# EAGLE design untitled (EAGLE 9.6.2)
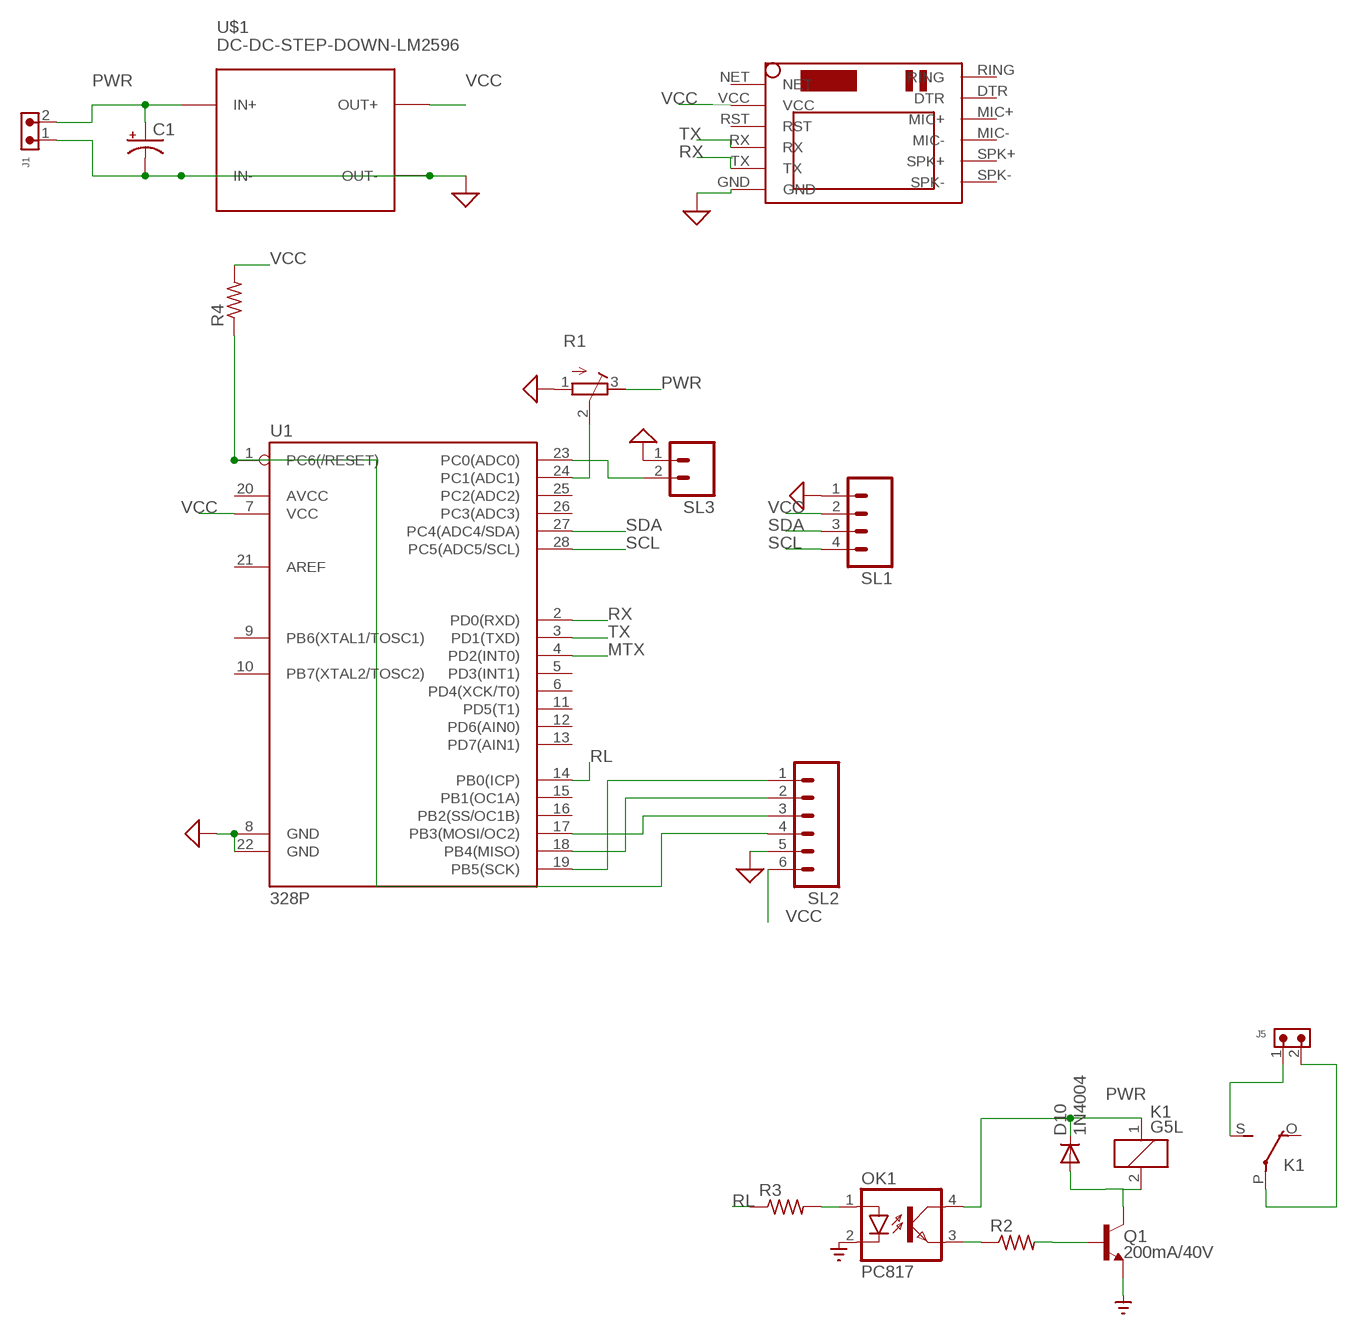
[diagram p0: schematic, sheet 1]

## Parts
C1  CPOL-USE7.5-16  [E7,5-16]
D10  1N4004  [DO41-10]
J1  691305530002  [691305530002]
J5  691305530002  [691305530002]
K1  G5L  [G5LE]
OK1  PC817  [DIL04]
Q1  200mA/40V  TRANS_NPN-2N3904  [TO-92]
R1  R-TRIMM3296Y  [RTRIM3296Y]
R2  R-US_0207/10  [0207/10]
R3  R-US_0207/12  [0207/12]
R4  R-US_0207/10  [0207/10]
SL1  M04  [04P]
SL2  M06  [06P]
SL3  M02  [02P]
U1  328P  ATMEGA328P_PDIP  [DIP28]
U$1  DC-DC-STEP-DOWN-LM2596  [DC-DC-STEP-DOWN-LM2596]
U$2  SIM800LMODULE  [SIM800LMODULE]

## Nets
GND: C1.- J1.1 OK1.2(C) Q1.1(E) R1.1(A) SL1.1 SL2.5 SL3.1 U1.8(GND) U1.22(GND) U$1.IN- U$1.OUT- U$2.GND ; supply symbol labelled SUP, SUPPLY_BRASTAN_GND_
MTX: U1.4(PD2(INT0))
N$1: OK1.1(A) R3.2
N$3: R1.2(S) U1.24(PC1(ADC1))
N$4: SL2.1 U1.19(PB5(SCK))
N$5: SL2.2 U1.18(PB4(MISO))
N$6: SL2.3 U1.17(PB3(MOSI/OC2))
N$7: R4.1 SL2.4 U1.1(PC6(/RESET))
N$8: SL3.2 U1.23(PC0(ADC0))
N$9: D10.A K1.2 Q1.3(C)
N$10: J5.2 K1.P(2:P)
N$11: J5.1 K1.S(2:S)
N$12: Q1.2(B) R2.2
N$13: OK1.3(EMIT) R2.1
PWR: C1.+ D10.C J1.2 K1.1 OK1.4(COL) R1.3(E) U$1.IN+
RL: R3.1 U1.14(PB0(ICP))
RX: U1.2(PD0(RXD)) U$2.TX
SCL: SL1.4 U1.28(PC5(ADC5/SCL))
SDA: SL1.3 U1.27(PC4(ADC4/SDA))
TX: U1.3(PD1(TXD)) U$2.RX
VCC: R4.2 SL1.2 SL2.6 U1.7(VCC) U$1.OUT+ U$2.VCC
Unconnected: K1.O(2:O) U1.5(PD3(INT1)) U1.6(PD4(XCK/T0)) U1.9(PB6(XTAL1/TOSC1)) U1.10(PB7(XTAL2/TOSC2)) U1.11(PD5(T1)) U1.12(PD6(AIN0)) U1.13(PD7(AIN1)) U1.15(PB1(OC1A)) U1.16(PB2(SS/OC1B)) U1.20(AVCC) U1.21(AREF) U1.25(PC2(ADC2)) U1.26(PC3(ADC3)) U$2.DTR U$2.MIC+ U$2.MIC- U$2.NET U$2.RING U$2.RST U$2.SPK+ U$2.SPK-

## Library data of the parts
C1 = rcl:CPOL-US: POLARIZED CAPACITOR, American symbol; SPICEPREFIX: C
D10 = adafruit:1N4004: DIODE General purpose 1N400x type rectifier (With bigger pads) http://www.ladyada.net/library/pcb/eaglelibrary.html
J1 J5 = Wurth_Connectors_WR-TBL Pluggable Connector:691305530002: WR-TBL Serie 3055 - 5,08 mm - PCB Header Vertical Entry with Plastic Latches KIND PROPERTIES Pitch 5.08 mm MATERIAL PROPERTIES Insulator Material PA66 Insulator Flammability Rating UL94 V-0 Insulator Color Green Terminal Material Copper Alloy Terminal Plating Tin-plated surface GENERAL INFORMATION Operating Temperature -40 up to +105 °C ELECTRICAL PROPERTIES IR UL 16 A Working Voltage [UL] 300 V (AC) Withstanding Voltage [UL] 2500 V (AC) Contact Resistance [UL] 20 mΩ CERTIFICATION UL Approval E315414 <https://www.we-online.com/catalog/media/o135349v209%20Family_WR-TBL3_6913055300xx.jpg> Details see: https://www.we-online.com/catalog/en/TBL_5_08_3055_6913055300XX/ Updated by Ella Wu 2019-12-30 2019(C) Wurth Elektronik; DATASHEET-URL: https://www.we-online.com/catalog/datasheet/691305530002.pdf; IR-UL: 16A; MOUNT: THT; PART-NUMBER: 691305530002; PINS: 2; PITCH: 5.08mm; TYPE: Vertical; WORKING-VOLTAGE-UL: 300V (AC)
K1 = relay:G5L: RELAY 1 x switch, 10 A/120 V AC, 8 A/30 V ADC, Omron; OC_FARNELL: unknown; OC_NEWARK: unknown
OK1 = optocoupler:PC817: SHARP OPTO COUPLER; MPN: PC817X4J000F; OC_FARNELL: 9707727; OC_NEWARK: 97K7059
Q1 = SparkFun-DiscreteSemi:TRANS_NPN: NPN transistor Current controlled devices typically used to amplify current or used as a switch. BC547 - COM-08928 <http://www.sparkfun.com/products/8928> (TO-92 45V 100mA) (1.Collector 2.Base 3.Emitter) 2N3904 - COM-00521 <http://www.sparkfun.com/products/521> (TO-92 40V 200mA) (1.Emitter 2.Base 3.Collector) P2N2222A - COM-12852 <http://www.sparkfun.com/products/12852> (TO-92 40V 600mA) (1.Collector 2.Base 3.Emitter); PROD_ID: TRANS-08447
R1 = rcl:R-TRIMM: Trimm resistor; SPICEMODEL: X; SPICEPREFIXL: POT
R2 R4 = BeagleBone_Black_Wireless:R-US_: RESISTOR, American symbol
R3 = adafruit:R-US_: RESISTOR, American symbol
SL1 = con-amp-quick:M04: AMP QUICK CONNECTOR; OC_FARNELL: unknown; OC_NEWARK: unknown
SL2 = con-amp-quick:M06: AMP QUICK CONNECTOR; OC_FARNELL: unknown; OC_NEWARK: unknown
SL3 = con-amp-quick:M02: AMP QUICK CONNECTOR; OC_FARNELL: unknown; OC_NEWARK: unknown
U1 = SparkFun-IC-Microcontroller:ATMEGA328P_PDIP: Atmel 328P Through hole ATMEGA328P uC used in the Arduino 32kb flash, 1k EEPROM, 2k SRAM Datasheet <http://www.sparkfun.com/datasheets/Components/SMD/ATMega328.pdf> SparkFun Products Storefront component: AVR 28 Pin 20MHz 32K 6A/D - ATMega328P <https://www.sparkfun.com/products/9061> (COM-09061) SparkFun Simon Says - Through-Hole Soldering Kit <https://www.sparkfun.com/products/10547> (KIT-10547) SparkFun Learn to Solder - Simon Says <https://www.sparkfun.com/products/13708> (KIT-13708) SparkFun BigTime Watch Kit <https://www.sparkfun.com/products/11734> (KIT-11734) SparkFun ClockIt <https://www.sparkfun.com/products/10930> (KIT-10930) SparkFun Serial Enabled LCD Kit <https://www.sparkfun.com/products/10097> (LCD-10097) SparkFun Simon Tilts - Through Hole Soldering Kit <https://www.sparkfun.com/products/12634> (KIT-12634) SparkFun Frequency Counter Kit <https://www.sparkfun.com/products/10140> (KIT-10140) FabFM Radio Kit <https://www.sparkfun.com/products/11043> (KIT-11043) SparkFun Binary Blaster Kit <https://www.sparkfun.com/products/12037> (KIT-12037) SparkFun Metro-Gnome <https://www.sparkfun.com/products/9236> (KIT-09236) ATmega328 with Arduino Optiboot (Uno) <https://www.sparkfun.com/products/10524> (DEV-10524); PROD_ID: IC-09136
U$1 = diy-modules:DC-DC-STEP-DOWN-LM2596: DC/DC Step-Down Regulator based on LM2596-ADJ chip LM2596 datasheet available here: http://www.ti.com/lit/ds/symlink/lm2596.pdf Click here to find device on ebay.com <http://www.ebay.com/sch/lm2596+power+regulator>
U$2 = SIM800LMODULE:SIM800LMODULE: SIM800L Module

## Board
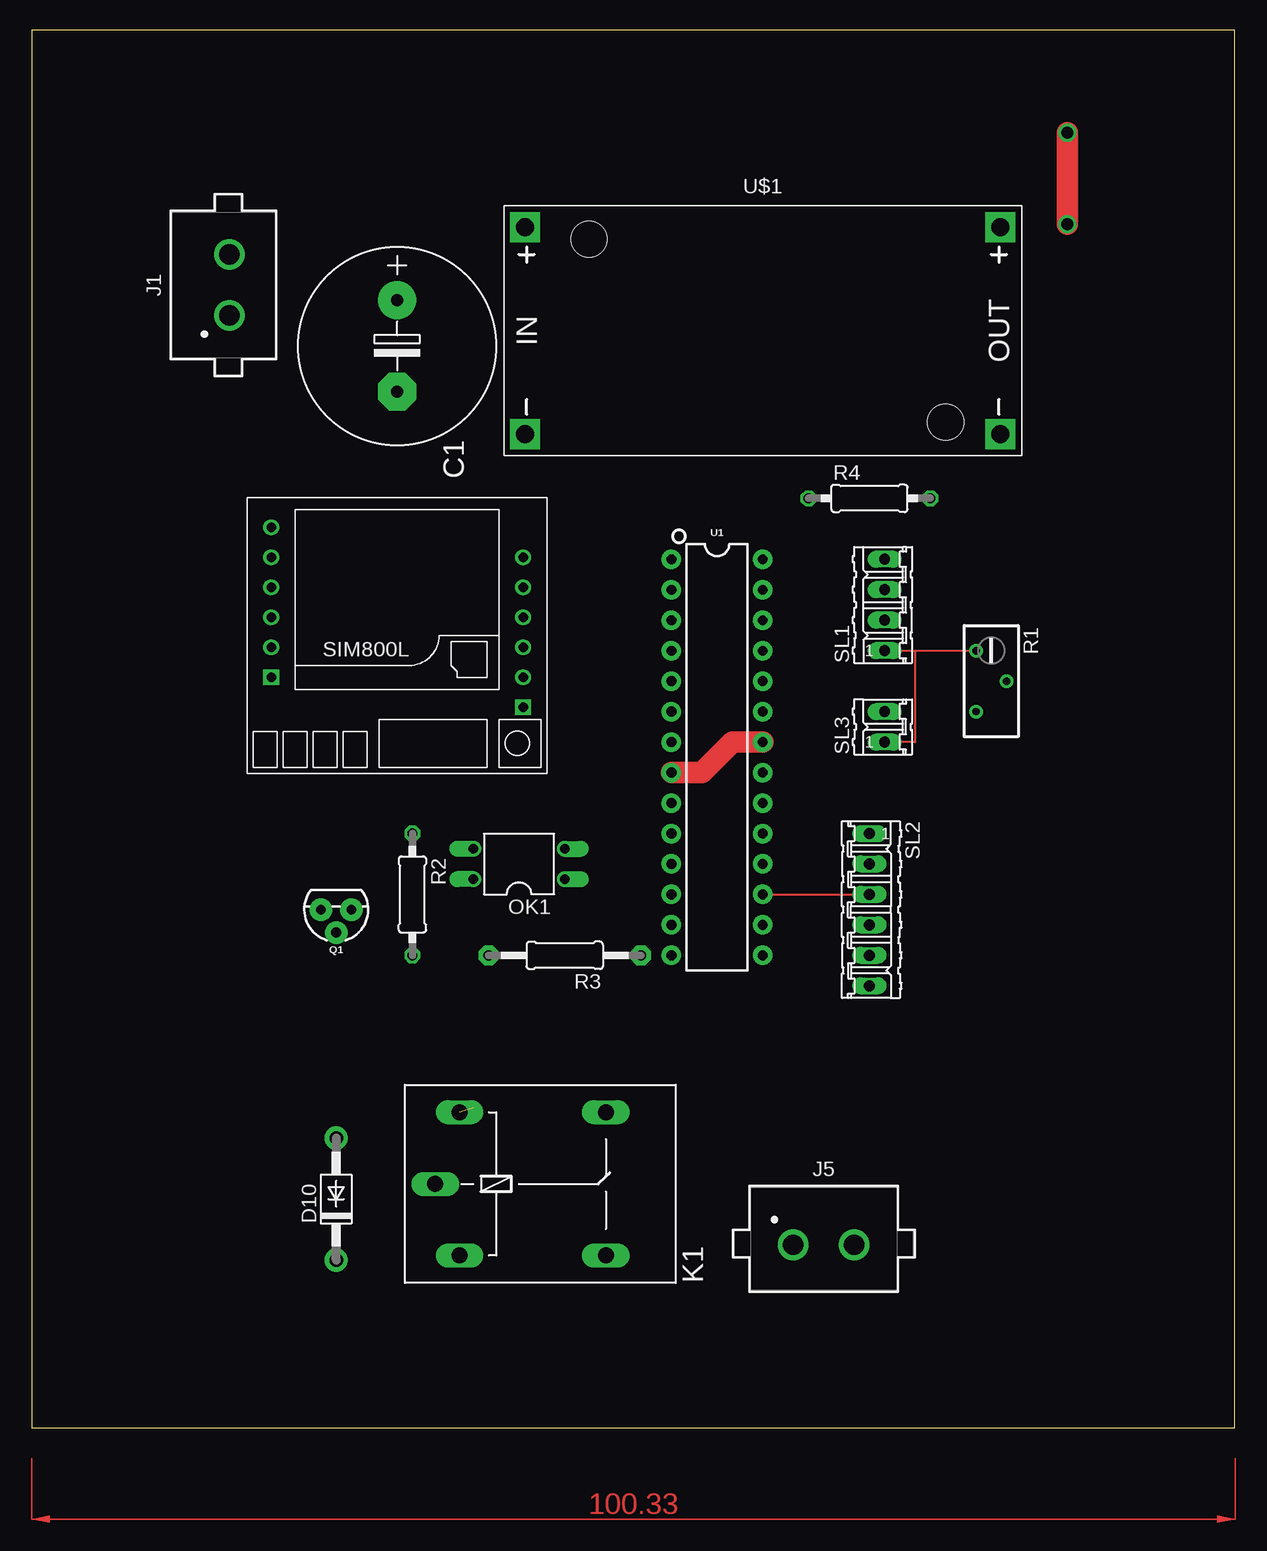
[diagram p1: board, top side]
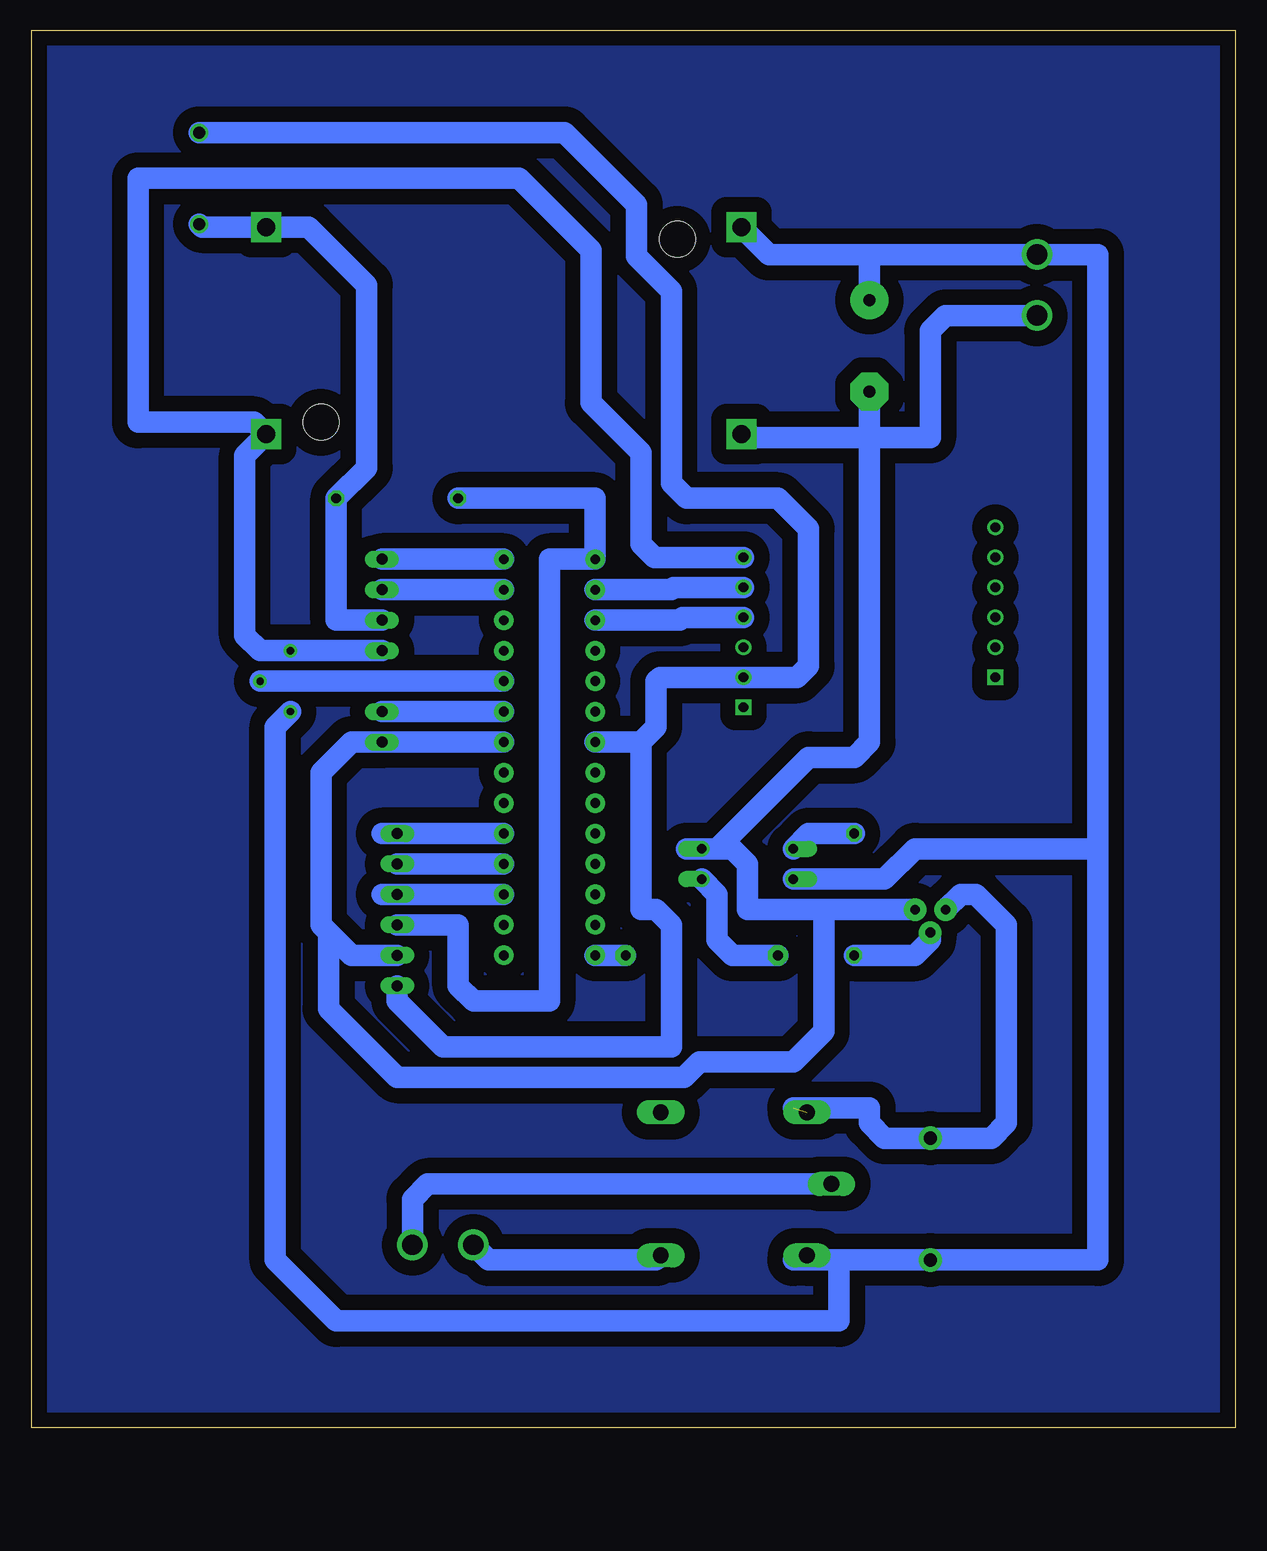
[diagram p2: board, bottom side, seen from below]

Size 100.31 x 116.51 mm. Coordinates in mm from the lower left corner, seen from the top.
Outline: 0,0 100.31,0 100.31,116.51 0,116.51 0,0
Copper layers (1*16): Top 0.035mm / dielectric 1.5mm / Bottom 0.035mm
Design rules "default *": minimum track width 6mil, minimum drill 0.35mm, track to track 30mil, track to pad 30mil, pad to pad 30mil, via to via 30mil, smd to smd 6mil, copper to edge 40mil, drill to drill 6mil, minimum pad ring 10mil, minimum via ring 8mil, stop-mask expansion 4mil, vias tented up to drill 0mil, thermal gap 10mil

### Footprints (pad centres in the part's own frame; a part is rotated, then mirrored left to right if it is on the bottom)
E7,5-16 = drill 1.016 pad 3.15: + -3.81,0 | drill 1.016 pad 3.15 octagon: - 3.81,0
DO41-10 = drill 1.118 pad 1.93: A 5.08,0; C -5.08,0
691305530002 = drill 1.7: 1 -2.54,0; 2 2.54,0
G5LE = drill 1.321 long: 1 -7.493,-5.969; 2 -7.493,5.969; O 4.699,5.969; P -9.525,0; S 4.699,-5.969
DIL04 = drill 0.813 offset: 1 -1.27,-3.81; 2 1.27,-3.81; 3 1.27,3.81; 4 -1.27,3.81
TO-92 = drill 0.813 pad 1.88: 1 -1.27,0; 2 0,1.905; 3 1.27,0
RTRIM3296Y = drill 0.61: 1 1.27,-2.54; 2 -1.27,0; 3 1.27,2.54
0207/10 = drill 0.813 octagon: 1 -5.08,0; 2 5.08,0
0207/12 = drill 0.813 pad 1.676 octagon: 1 -6.35,0; 2 6.35,0
04P = drill 0.914 long: 1 -3.81,0; 2 -1.27,0; 3 1.27,0; 4 3.81,0
06P = drill 0.914 long: 1 -6.35,0; 2 -3.81,0; 3 -1.27,0; 4 1.27,0; 5 3.81,0; 6 6.35,0
02P = drill 0.914 long: 1 -1.27,0; 2 1.27,0
DIP28 = drill 0.813 pad 1.626: 1 -16.51,-3.81; 2 -13.97,-3.81; 3 -11.43,-3.81; 4 -8.89,-3.81; 5 -6.35,-3.81; 6 -3.81,-3.81; 7 -1.27,-3.81; 8 1.27,-3.81; 9 3.81,-3.81; 10 6.35,-3.81; 11 8.89,-3.81; 12 11.43,-3.81; 13 13.97,-3.81; 14 16.51,-3.81; 15 16.51,3.81; 16 13.97,3.81; 17 11.43,3.81; 18 8.89,3.81; 19 6.35,3.81; 20 3.81,3.81; 21 1.27,3.81; 22 -1.27,3.81; 23 -3.81,3.81; 24 -6.35,3.81; 25 -8.89,3.81; 26 -11.43,3.81; 27 -13.97,3.81; 28 -16.51,3.81
DC-DC-STEP-DOWN-LM2596 = drill 1.5 pad 2.5 square: IN+ -19.812,8.636; IN- -19.812,-8.636; OUT+ 19.812,8.636; OUT- 19.812,-8.636 | hole 3: -14.478,7.62; 15.24,-7.62
SIM800LMODULE = drill 0.8: DTR 10.5,1; GND -10.5,-6.5; MIC+ 10.5,-1.5; MIC- 10.5,-4; RST -10.5,1; RX -10.5,-1.5; SPK+ 10.5,-6.5; SPK- 10.5,-9; TX -10.5,-4; VCC -10.5,3.5 | drill 0.8 square: NET -10.5,6; RING 10.5,3.5

### Placement (x,y rotation side)
C1  30.48,90.17 270 top
D10  25.4,19.05 90 top
J1  16.51,95.25 90 top
J5  66.04,15.24 0 top
K1  43.18,20.32 0 top
OK1  40.64,46.99 90 top
Q1  25.4,43.18 180 top
R1  80.01,62.23 180 top
R2  31.75,44.45 270 top
R3  44.45,39.37 180 top
R4  69.85,77.47 0 top
SL1  71.12,68.58 90 top
SL2  69.85,43.18 270 top
SL3  71.12,58.42 90 top
U1  57.15,55.88 270 top
U$1  60.96,91.44 0 top
U$2  30.48,66.04 180 top

### Tracks (layer width: path | path; a pad name or v marks a point on that pad's centre or on a via)
GND
  Top 0.152: 41.27,73.02 U$2.GND | 41.27,82.55 U$1.IN- | SL1.1 73.66,64.77 | 73.66,64.77 R1.1 | 80.65,82.55 U$1.OUT- | SL3.1 73.66,57.15 73.66,64.77
  Top 1.778: U1.8 55.88,54.61 58.42,57.15 U1.22
  Bottom 1.778: SL1.1 R1.1 81.28,64.77 82.55,66.04 82.55,81.03 U$1.OUT- 81.79,83.82 91.44,83.82 91.44,104.14 59.69,104.14 53.7,98.15 53.7,85.45 49.53,81.28 49.53,73.66 48.41,72.54 U$2.GND | U1.22 SL3.1 73.66,57.15 76.2,54.61 76.2,41.91 75.56,41.27 | SL2.5 73.66,39.37 75.56,41.27 | Q1.1 34.29,43.18 | 34.29,43.18 40.64,43.18 40.64,46.99 41.91,48.26 43.18,48.26 | 43.18,48.26 OK1.2 45.72,48.26 | 75.56,41.27 75.56,34.92 69.85,29.21 45.94,29.21 44.67,30.48 36.83,30.48 34.29,33.02 34.29,43.18 | 43.18,48.26 35.56,55.88 31.75,55.88 30.48,57.15 30.48,82.55 | J1.1 24.13,92.71 25.4,91.44 25.4,82.55 30.48,82.55 | U$1.IN- 40.89,82.55 30.48,82.55 | C1.- 30.48,82.55
N$1
  Bottom 1.778: R3.2 41.91,39.37 43.18,40.64 43.18,44.45 OK1.1
N$2
  pour Bottom (isolate 1.27): 0,116.84 100.33,116.84 100.33,0 0,0
N$3
  Bottom 1.778: U1.24 R1.2
N$4
  Bottom 1.778: U1.19 SL2.1 71.12,49.53
N$5
  Bottom 1.778: SL2.2 U1.18
N$6
  Top 0.152: U1.17 SL2.3
  Bottom 1.778: U1.17 71.12,44.45
N$7
  Bottom 1.778: SL2.4 64.77,41.91 64.77,36.83 63.5,35.56 57.15,35.56 57.15,72.39 U1.1 53.34,77.47 R4.1
N$8
  Bottom 1.778: U1.23 SL3.2
N$9  (1 unrouted)
  Top 0.152: 23.5,42.55 Q1.3 | 35.56,26.67 K1.2
  Bottom 1.778: Q1.3 22.86,44.45 21.59,44.45 19.05,41.91 19.05,25.4 20.32,24.13 D10.A 29.21,24.13 30.48,25.4 30.48,26.67 36.83,26.67
N$10
  Bottom 1.778: K1.P 67.31,20.32 68.58,19.05 J5.2
N$11
  Bottom 1.778: J5.1 62.23,13.97 48.26,13.97 K1.S
N$12
  Bottom 1.778: R2.2 26.67,39.37 25.4,40.64 Q1.2
N$13
  Bottom 1.778: OK1.3 35.56,49.53 R2.1
PWR
  Bottom 1.778: U$1.IN+ 38.86,97.79 30.48,97.79 | 30.48,97.79 J1.2 11.43,97.79 11.43,48.26 | C1.+ 30.48,97.79 | 11.43,48.26 11.43,13.97 D10.C 33.02,13.97 | 33.02,13.97 35.56,13.97 | 35.56,13.97 36.83,13.97 | K1.1 35.69,14.1 35.56,13.97 | OK1.4 29.21,45.72 26.67,48.26 11.43,48.26 | 33.02,13.97 33.02,8.89 74.93,8.89 80.01,13.97 80.01,58.42 R1.3
RL
  Bottom 1.778: R3.1 U1.14
RX
  Bottom 1.778: U$2.TX 46.8,70.04 46.99,69.85 U1.2
SCL
  Bottom 1.778: U1.28 SL1.4
SDA
  Bottom 1.778: SL1.3 U1.27
TX
  Bottom 1.778: U$2.RX 46.06,67.54 46.29,67.31 U1.3
VCC  (via drill 1)
  Top 1.778: v86.36,107.95 v86.36,100.33
  Bottom 1.778: 49.53,57.15 48.26,58.42 48.26,62.23 47.95,62.54 U$2.VCC 36.52,62.54 35.56,63.5 35.56,74.93 38.1,77.47 45.72,77.47 46.99,78.74 46.99,94.75 49.89,97.65 49.89,101.96 55.88,107.95 v86.36,107.95 | 49.53,57.15 U1.7 | SL1.2 74.93,67.31 R4.2 72.39,80.01 72.39,95.25 77.22,100.08 U$1.OUT+ 86.11,100.08 v86.36,100.33 | SL2.6 69.85,35.56 66.04,31.75 46.99,31.75 46.99,41.91 48.26,43.18 49.53,43.18 49.53,57.15
(copper drawn outside any net)
  shapes: Top area x2